# Altium schematic sheet Inputs.SchDoc
size A4
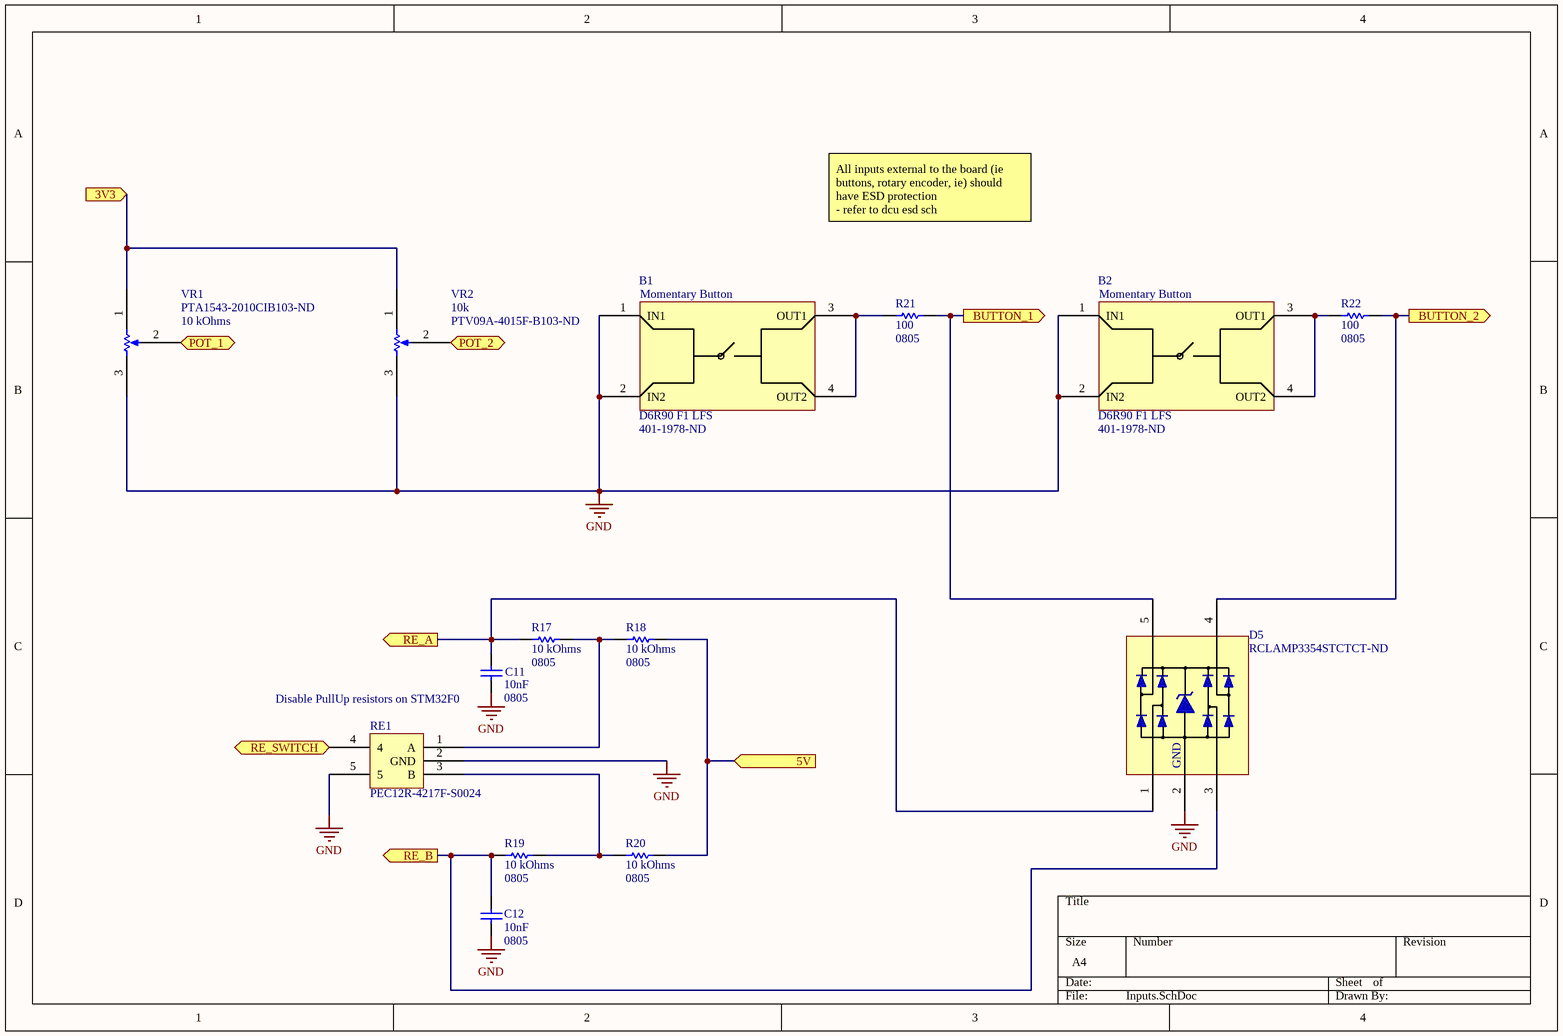
[diagram p0: Inputs.SchDoc]

## Parts
B1  D6R90 F1 LFS  Supplier Part Number 1: 401-1978-ND  [MomentaryButton]
B2  D6R90 F1 LFS  Supplier Part Number 1: 401-1978-ND  [MomentaryButton]
C11  Capacitance: 10nF  Package / Case: 0805  [CAP0805]  (hidden comment: CGA4C2C0G1H103J060AA)
C12  Capacitance: 10nF  Package / Case: 0805  [CAP0805]  (hidden comment: CGA4C2C0G1H103J060AA)
D5  Supplier Part Number 1: RCLAMP3354STCTCT-ND  [SOT95P280X145-5N]  (hidden comment: RCLAMP3354S.TCT)
R17  Resistance: 10 kOhms  Package / Case: 0805  [RES0805]  (hidden comment: RC0805FR-0710KL)
R18  Resistance: 10 kOhms  Package / Case: 0805  [RES0805]  (hidden comment: RC0805FR-0710KL)
R19  Resistance: 10 kOhms  Package / Case: 0805  [RES0805]  (hidden comment: RC0805FR-0710KL)
R20  Resistance: 10 kOhms  Package / Case: 0805  [RES0805]  (hidden comment: RC0805FR-0710KL)
R21  Resistance (Ohms): 100  Package / Case: 0805  [RES0805]  (hidden comment: RC0805FR-07100RL)
R22  Resistance (Ohms): 100  Package / Case: 0805  [RES0805]  (hidden comment: RC0805FR-07100RL)
RE1  PEC12R-4217F-S0024  [Bourns Inc. PEC12R-4217F-S0024]
VR1  Supplier Part Number 1: PTA1543-2010CIB103-ND  Resistance: 10 kOhms  [PTA1543-2010CIB103]  (hidden comment: PTA1543-2010CIB103)
VR2  Resistance (Ohms): 10k  Supplier Part Number 1: PTV09A-4015F-B103-ND  [PTV09A-4015F-B103]  (hidden comment: PTV09A-4015F-B103)

## Ports
3V3 (in), 5V (in), BUTTON_1 (out), BUTTON_2 (out), POT_1 (out), POT_2 (out), RE_A (out), RE_B (out), RE_SWITCH (out)

## Nets
GND: B1.1(IN1) B1.2(IN2) B2.1(IN1) B2.2(IN2) C11.2 C12.1 D5.2(GND) RE1.2(GND) RE1.5 VR1.3 VR2.3
3V3: VR1.1 VR2.1 ; port 3V3
5V: R18.1 R20.2 ; port 5V
BUTTON_1: D5.5 R21.2 ; port BUTTON_1
BUTTON_2: D5.4 R22.2 ; port BUTTON_2
POT_1: VR1.2 ; port POT_1
POT_2: VR2.2 ; port POT_2
RE_A: C11.1 D5.1 R17.2 ; port RE_A
RE_B: C12.2 D5.3 R19.2 ; port RE_B
RE_SWITCH: RE1.4 ; port RE_SWITCH
NetB1_3: B1.3(OUT1) B1.4(OUT2) R21.1
NetB2_3: B2.3(OUT1) B2.4(OUT2) R22.1
NetR17_1: R17.1 R18.2 RE1.1(A)
NetR19_1: R19.1 R20.1 RE1.3(B)

## Notes on the sheet
- All inputs external to the board (ie buttons, rotary encoder, ie) should have ESD protection
  - refer to dcu esd sch
- (near C11) Disable PullUp resistors on STM32F0
- (in symbol D6R90 F1 LFS) Momentary Button

## Library data of the parts
B1 B2 = D6R90 F1 LFS: SWITCH PUSH SPST-NO 0.1A 32V; Detailed Description: Pushbutton Switch SPST-NO Keyswitch Through Hole; Switch Function: Off-Mom; Current Rating: 100ma (DC); Electrical Life: 250,000 Cycles; Voltage Rating - DC: 32V; Mounting Type: Through Hole; Supplier 1: Digi-Key
C11 C12 = CGA4C2C0G1H103J060AA: CAP CER 10000PF 50V C0G 0805; Tolerance: ±5%; Supplier 1: Digi-Key; Supplier Part Number 1: 445-6947-1-ND; Voltage - Rated: 50V; Thickness: 0.7mm; Operating Temperature: -55°C ~ 125°C
D5 = RCLAMP3354S.TCT: TVS DIODE 3.3VWM 16VC; Supplier 1: Digi-Key
R17-R20 = RC0805FR-0710KL: RES SMD 10K OHM 1% 1/8W 0805; Manufacturer: Yageo; Power (Watts): 0.125W, 1/8W; Temperature Coefficient: ±100ppm/°C; Supplier 1: Digi-Key; Supplier Part Number 1: 311-10.0KCRCT-ND; Tolerance: ±1%; Composition: Thick Film; Features: Moisture Resistant; Operating Temperature: -55°C ~ 155°C
R21 R22 = RC0805FR-07100RL: RES SMD 100 OHM 1% 1/8W 0805; Power (Watts): 0.125W, 1/8W; Tolerance: ±1%; Composition: Thick Film; Supplier 1: Digi-Key; Supplier Part Number 1: 311-100CRCT-ND
RE1 = PEC12R-4217F-S0024: ENCODER ROTARY; Encoder Type: Mechanical; Output Type: Quadrature (Incremental); Pulses per Revolution: 24; Actuator Type: 6mm Dia Flatted End; Detent: Yes; Rotational Life (Cycles Min): 30K; Supplier 1: Digi-Key; Supplier Part Number 1: PEC12R-4217F-S0024-ND; Voltage - Supply: -; Built in Switch: Yes; Mounting Type: PCB, Through Hole; Orientation: Vertical
VR1 = PTA1543-2010CIB103: POT SLIDE 10K OHM .05W 15MM; Detailed Description: 0.05W, 1/20W Through Hole Slide Potentiometer Top Adjustment Type; Power (Watts): 0.05W, 1/20W; Tolerance: ±20%; Fader Type: Standard; Supplier 1: Digi-Key; Travel Range: 15mm; Mounting Type: Through Hole
VR2 = PTV09A-4015F-B103: POT 10K OHM 1/20W CARBON LINEAR; Detailed Description: 10k Ohm Gang Linear Through Hole, Snap In Potentiometer None 1 Turn Carbon 0.05W, 1/20W PC Pins, Board Locks; Tolerance: ±20%; Power (Watts): 0.05W, 1/20W; Built in Switch: None; Rotation: 280°; Supplier 1: Digi-Key; Mounting Type: Through Hole, Snap In; Termination Style: PC Pins, Board locks